# EAGLE schematic Circuit XIAO and 0.96 Display (EAGLE 9.7.0)
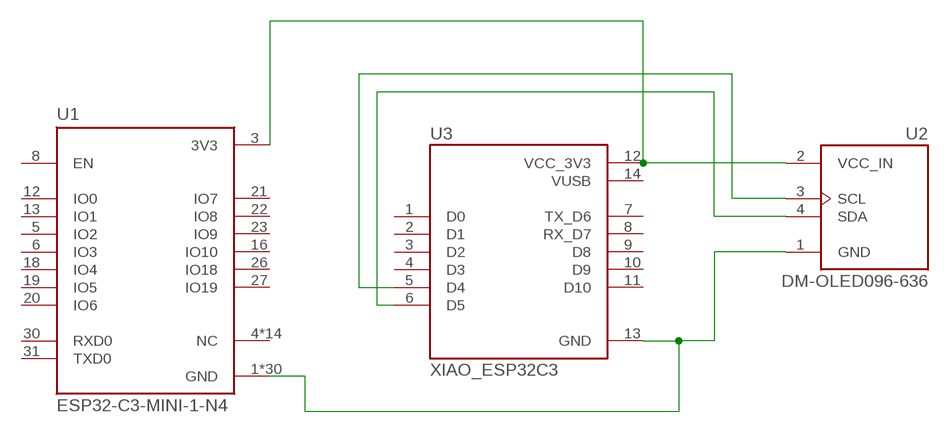
[diagram p0: schematic, sheet 1]

## Parts
U1  ESP32-C3-MINI-1-N4  [XCVR_ESP32-C3-MINI-1-N4]
U2  DM-OLED096-636  [MODULE_DM-OLED096-636]
U3  XIAO_ESP32C3  [MODULE_XIAO_ESP32C3]

## Nets
N$1: U1.1(GND) U1.2(GND) U1.11(GND) U1.14(GND) U1.36(GND) U1.37(GND) U1.38(GND) U1.39(GND) U1.40(GND) U1.41(GND) U1.42(GND) U1.43(GND) U1.44(GND) U1.45(GND) U1.46(GND) U1.47(GND) U1.48(GND) U1.49_1(GND) U1.49_2(GND) U1.49_3(GND) U1.49_4(GND) U1.49_5(GND) U1.49_6(GND) U1.49_7(GND) U1.49_8(GND) U1.49_9(GND) U1.50(GND) U1.51(GND) U1.52(GND) U1.53(GND) U2.1(GND) U3.13(GND)
N$2: U1.3(3V3) U2.2(VCC_IN) U3.12(VCC_3V3)
N$3: U2.3(SCL) U3.5(D4)
N$4: U2.4(SDA) U3.6(D5)
Unconnected: U1.4(NC) U1.5(IO2) U1.6(IO3) U1.7(NC) U1.8(EN) U1.9(NC) U1.10(NC) U1.12(IO0) U1.13(IO1) U1.15(NC) U1.16(IO10) U1.17(NC) U1.18(IO4) U1.19(IO5) U1.20(IO6) U1.21(IO7) U1.22(IO8) U1.23(IO9) U1.24(NC) U1.25(NC) U1.26(IO18) U1.27(IO19) U1.28(NC) U1.29(NC) U1.30(RXD0) U1.31(TXD0) U1.32(NC) U1.33(NC) U1.34(NC) U1.35(NC) U3.1(D0) U3.2(D1) U3.3(D2) U3.4(D3) U3.7(TX_D6) U3.8(RX_D7) U3.9(D8) U3.10(D9) U3.11(D10)

## Power pins joined to a net without a drawn wire
VUSB: U3.14(VUSB)

## Library data of the parts
U1 = ESP32-C3-MINI-1-N4:ESP32-C3-MINI-1-N4: Check availability <https://pricing.snapeda.com/parts/ESP32-C3-MINI-1-N4/Espressif%20Systems/view-part?ref=eda>
U2 = DM-OLED096-636:DM-OLED096-636: Check availability <https://pricing.snapeda.com/parts/DM-OLED096-636/Display%20Module/view-part?ref=eda>
U3 = XIAO_ESP32C3:XIAO_ESP32C3: Check availability <https://pricing.snapeda.com/parts/XIAO%20ESP32C3/Seeed%20Studio/view-part?ref=eda>